# Altium schematic sheet ESP32-Interfacesv02b.SchDoc
size B; DrawnBy: Erik Fountain; DocumentNumber: 3; SheetNumber: 3; SheetTotal: 5; PageSetup: Record=PageOptions|CenterHorizontal=True|CenterVertical=True|PrintScale=0.72|XCorrection=1.00|YCorrection=1.00|PrintKind=0|BorderSize=5000000|LeftOffset=0|BottomOffset=0|Orientation=2|PaperLength=1000|PaperWidth=1000|Scale=100|PaperSource=7|PrintQuality=-4|MediaType=1|DitherType=10|PaperKind=Letter|PrintScaleMode=1
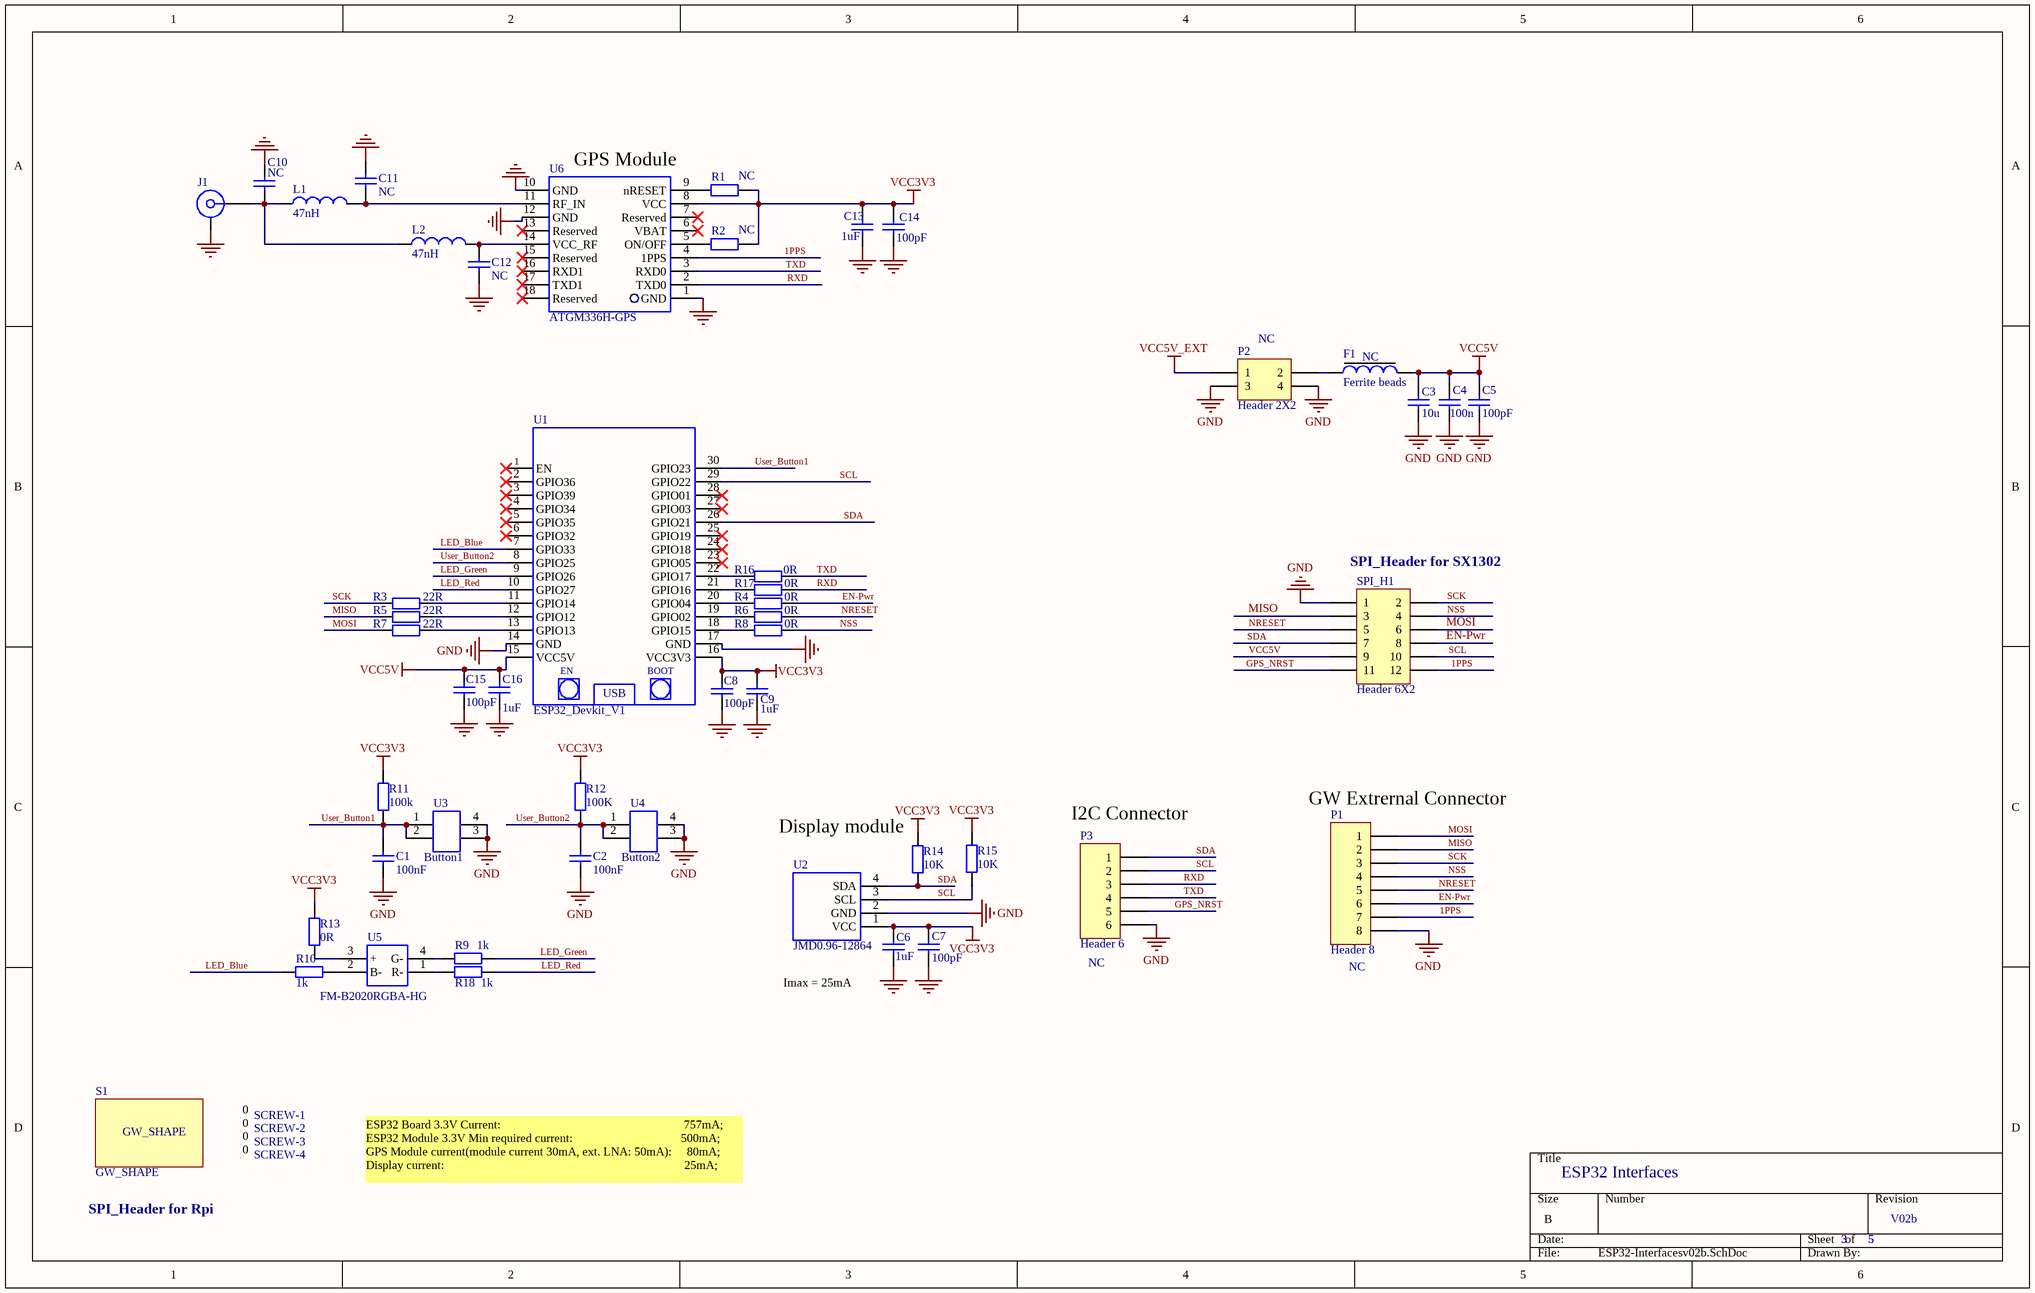
[diagram p0: ESP32-Interfacesv02b.SchDoc]

## Parts
C1  value 100nF  [rlc_603_smd]  (hidden comment: Cap)
C2  value 100nF  [rlc_603_smd]  (hidden comment: Cap)
C3  value 10u  [rlc_805_smd]  (hidden comment: Cap)
C4  value 100n  [rlc_603_smd]  (hidden comment: Cap)
C5  value 100pF  [rlc_603_smd]  (hidden comment: Cap)
C6  value 1uF  [rlc_603_smd]  (hidden comment: Cap)
C7  value 100pF  [rlc_603_smd]  (hidden comment: Cap)
C8  value 100pF  [rlc_603_smd]  (hidden comment: Cap)
C9  value 1uF  [rlc_603_smd]  (hidden comment: Cap)
C10  value NC  [rlc_402_smd]  (hidden comment: Cap)
C11  value NC  [rlc_402_smd]  (hidden comment: Cap)
C12  value NC  [rlc_402_smd]  (hidden comment: Cap)
C13  value 1uF  [rlc_603_smd]  (hidden comment: Cap)
C14  value 100pF  [rlc_603_smd]  (hidden comment: Cap)
C15  value 100pF  [rlc_603_smd]  (hidden comment: Cap)
C16  value 1uF  [rlc_603_smd]  (hidden comment: Cap)
F1  Ferrite beads  value NC  [rlc_603_smd]
J1  32K145-400L5  [ROS-32K145-400L5_V]  (value not drawn)
L1  value 47nH  [rlc_402_smd]  (hidden comment: Inductor)
L2  value 47nH  [rlc_402_smd]  (hidden comment: Inductor)
P1  Header 8  [HDR1X8]
P2  Header 2X2  [HDR2X2]
P3  Header 6  [HDR1X6]
R1  value NC  [rlc_402_smd]  (hidden comment: Resistor)
R2  value NC  [rlc_402_smd]  (hidden comment: Resistor)
R3  value 22R  [rlc_402_smd]  (hidden comment: Resistor)
R4  value 0R  [rlc_402_smd]  (hidden comment: Resistor)
R5  value 22R  [rlc_402_smd]  (hidden comment: Resistor)
R6  value 0R  [rlc_402_smd]  (hidden comment: Resistor)
R7  value 22R  [rlc_402_smd]  (hidden comment: Resistor)
R8  value 0R  [rlc_402_smd]  (hidden comment: Resistor)
R9  value 1k  [rlc_402_smd]  (hidden comment: Resistor)
R10  value 1k  [rlc_402_smd]  (hidden comment: Resistor)
R11  value 100k  [rlc_402_smd]  (hidden comment: Resistor)
R12  value 100K  [rlc_402_smd]  (hidden comment: Resistor)
R13  value 0R  [rlc_402_smd]  (hidden comment: Resistor)
R14  value 10K  [rlc_402_smd]  (hidden comment: Resistor)
R15  value 10K  [rlc_402_smd]  (hidden comment: Resistor)
R16  value 0R  [rlc_402_smd]  (hidden comment: Resistor)
R17  value 0R  [rlc_402_smd]  (hidden comment: Resistor)
R18  value 1k  [rlc_402_smd]  (hidden comment: Resistor)
S1  GW_SHAPE  [GW_SHAPE]
SCREW-1  Logo symbol  [screw-M3]  (value not drawn)
SCREW-2  Logo symbol  [SCREW-M3]  (value not drawn)
SCREW-3  Logo symbol  [screw-M3]  (value not drawn)
SCREW-4  Logo symbol  [SCREW-M3]  (value not drawn)
SPI_H1  Header 6X2  [header_6_2_2.0]
U1  ESP32_Devkit_V1  [ESP32-DOIT-30]
U2  JMD0.96-12864  [JMD0.96_12864]
U3  Button1  [TACT SWITCH_8HA-A-S1-01 - duplicate]
U4  Button2  [TACT SWITCH_8HA-A-S1-01 - duplicate]
U5  FM-B2020RGBA-HG  [RGB_2020]
U6  ATGM336H-GPS  [ATGM336H]

## Nets
GND: C1.2 C2.2 C3.1 C4.1 C5.1 C6.2 C7.2 C8.2 C9.2 C10.2 C11.1 C12.1 C13.1 C14.1 C15.2 C16.2 J1.MP P1.8 P2.3 P2.4 P3.6 SPI_H1.1 U1.14(GND) U1.17(GND) U2.2(GND) U3.3 U3.4 U4.3 U4.4 U6.1(GND) U6.10(GND) U6.12(GND)
VCC3V3: C6.1 C7.1 C8.1 C9.1 C13.2 C14.2 R1.2 R2.2 R11.1 R12.1 R13.2 R14.1 R15.1 U1.16(VCC3V3) U2.1(VCC) U6.8(VCC)
VCC5V: C3.2 C4.2 C5.2 C15.1 C16.1 F1.2 SPI_H1.9 U1.15(VCC5V)
VCC5V_EXT: P2.1
1PPS: P1.7 SPI_H1.12 U6.4(1PPS)
EN-Pwr: P1.6 R4.2 SPI_H1.8
GPS_NRST: P3.5 SPI_H1.11
LED_Blue: R10.2 U1.7(GPIO33)
LED_Green: R9.1 U1.9(GPIO26)
LED_Red: R18.1 U1.10(GPIO27)
MISO: P1.2 R5.1 SPI_H1.3
MOSI: P1.1 R7.1 SPI_H1.6
NRESET: P1.5 R6.2 SPI_H1.5
NSS: P1.4 R8.2 SPI_H1.4
RXD: P3.3 R17.2 U6.2(TXD0)
SCK: P1.3 R3.1 SPI_H1.2
SCL: P3.2 R15.2 SPI_H1.10 U1.29(GPIO22) U2.3(SCL)
SDA: P3.1 R14.2 SPI_H1.7 U1.26(GPIO21) U2.4(SDA)
TXD: P3.4 R16.2 U6.3(RXD0)
User_Button1: C1.1 R11.2 U1.30(GPIO23) U3.1 U3.2
User_Button2: C2.1 R12.2 U1.8(GPIO25) U4.1 U4.2
NetC10_1: C10.1 J1.1 L1.1 L2.1
NetC11_2: C11.2 L1.2 U6.11(RF_IN)
NetC12_2: C12.2 L2.2 U6.14(VCC_RF)
NetF1_1: F1.1 P2.2
NetR1_1: R1.1 U6.9(nRESET)
NetR2_1: R2.1 U6.5(ON/OFF)
NetR3_2: R3.2 U1.11(GPIO14)
NetR4_1: R4.1 U1.20(GPIO04)
NetR5_2: R5.2 U1.12(GPIO12)
NetR6_1: R6.1 U1.19(GPIO02)
NetR7_2: R7.2 U1.13(GPIO13)
NetR8_1: R8.1 U1.18(GPIO15)
NetR9_2: R9.2 U5.4(G-)
NetR10_1: R10.1 U5.2(B-)
NetR13_1: R13.1 U5.3(+)
NetR16_1: R16.1 U1.22(GPIO17)
NetR17_1: R17.1 U1.21(GPIO16)
NetR18_2: R18.2 U5.1(R-)

Not connected (* = marked no-connect by the designer): SCREW-1 0; SCREW-2 0; SCREW-3 0; SCREW-4 0; U1 1(EN)* 2(GPIO36)* 3(GPIO39)* 4(GPIO34)* 5(GPIO35)* 6(GPIO32)* 23(GPIO05)* 24(GPIO18)* 25(GPIO19)* 27(GPIO03)* 28(GPIO01)*; U6 6(VBAT)* 7(Reserved)* 13(Reserved)* 15(Reserved)* 16(RXD1)* 17(TXD1)* 18(Reserved)*

## Notes on the sheet
- (near U6) GPS Module
- (near P2) NC
- (near SPI_H1) SPI_Header for SX1302
- (near R14) Display module
- (near P3) I2C Connector
- (near P1) GW Extrernal Connector
- (near P3) NC
- (near P1) NC
- Imax = 25mA
- ESP32 Board 3.3V Current:                                                             757mA;
  ESP32 Module 3.3V Min required current:                                    500mA;
  GPS Module current(module current 30mA, ext. LNA: 50mA):     80mA;
  Display current:                                                                                25mA;
- ESP32 Interfaces
- SPI_Header for Rpi
- V02b
- (in symbol ESP32_Devkit_V1) BOOT; USB

## Library data of the parts
C1-C16 = Cap: Capacitor SMD; Published: 8-Jun-2000; LatestRevisionDate: 05-oct-2007  -  Semtech; LatestRevisionNote: Re-released for DXP Platform.; Publisher: Altium Limited
J1 = 32K145-400L5: SMA Right Angle Jack, Edge Mount, Up to 18 GHz, -55 to 155 degC; Design Note 1: Footprint in library is a generic example - only application specific footprint delivers High Performance; Desgin Note 2: For more information about DRC setting, please look at following webpage, http://techdocs.altium.com/display/SCRT/Design+Rule+for+Edge-Mount+Connectors; DatasheetVersion: b00; PackageVersion: b00; PackageReference: 32K145-400L5; PackageDescription: SMA Right Angle Jack, Edge Mount, 14.25 x 9.5 x 4.46 mm; Mounting Technology: Surface Mount; PartNumber: 32K145-400L5; ComponentLink1Description: Manufacturer URL; ComponentLink1URL: http://www.rosenberger.de; ComponentLink2Description: Datasheet; ComponentLink2URL: http://rosenberger.de/ok/images/documents/db/32K145-400L5.pdf; ComponentLink3Description: Package Specification; ComponentLink3URL: http://rosenberger.de/ok/images/documents/db/32K145-400L5.pdf; ComponentLink4Description: Series Overview / Design Note; ComponentLink4URL: http://rosenberger.de/ok/images/documents/spez/32.pdf; ComponentLink5Description: Webshop / RFQ; ComponentLink5URL: http://www.rosenberger.com/en/contact/sales/
L1 L2 = Inductor: Inductor SMD; Code_IEC: 1005; Published: 8-Jun-2000; LatestRevisionDate: 05-oct-2007  -  Semtech; LatestRevisionNote: Re-released for DXP Platform.; Publisher: Altium Limited; Code_JEITA: 0402
P1 = Header 8: Header, 8-Pin; LatestRevisionDate: 17-Jul-2002; LatestRevisionNote: Re-released for DXP Platform.; Publisher: Altium Limited
P2 = Header 2X2: Header, 2-Pin, Dual row; LatestRevisionDate: 17-Jul-2002; LatestRevisionNote: Re-released for DXP Platform.; Publisher: Altium Limited
P3 = Header 6: Header, 6-Pin; LatestRevisionDate: 17-Jul-2002; LatestRevisionNote: Re-released for DXP Platform.; Publisher: Altium Limited
R1-R18 = Resistor: Resistor SMD - IEC symbol version; LatestRevisionDate: 27-Jul-20  -  Semtech
SCREW-1-SCREW-4 = Logo: Schematic symbol for Logo
SPI_H1 = Header 6X2: Header, 12-Pin, Dual row; LatestRevisionDate: 17-Jul-2002; LatestRevisionNote: Re-released for DXP Platform.; Publisher: Altium Limited
U2 = 0.96oled-12864
U3 U4 = TACT SWITCH_8HA-A-S1-01
U5 = RGB_LED
U6 = ATGM336H
S1 = GW_SHAPE: LatestRevisionDate: 17-Jul-2002; LatestRevisionNote: Re-released for DXP Platform.; Publisher: Altium Limited